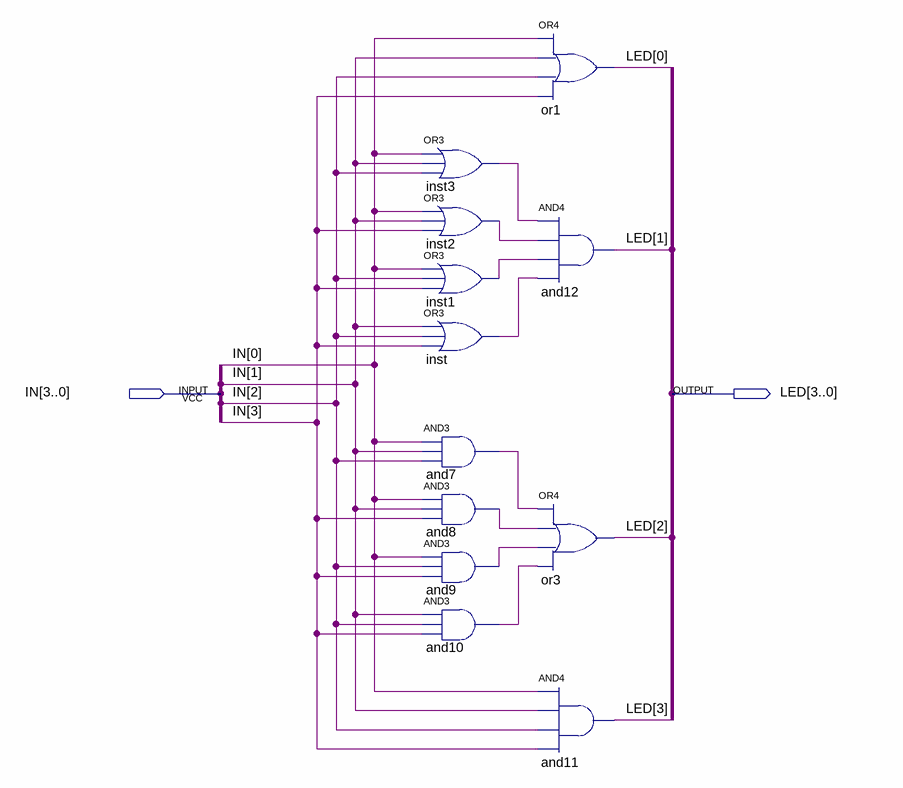
[diagram p0: schematic sheet]
// Quartus schematic SALIDA_LED.bdf as structural Verilog: 12 symbols, 2 pins
module SALIDA_LED (
  input  [3:0] IN,
  output [3:0] LED
);

  wire and7_out, and8_out, and9_out, and10_out, inst1_out, inst2_out, inst3_out, inst_out;

  or inst3 (inst3_out, IN[0], IN[1], IN[2]);
  or inst2 (inst2_out, IN[0], IN[1], IN[3]);
  or inst1 (inst1_out, IN[0], IN[2], IN[3]);
  or inst (inst_out, IN[1], IN[2], IN[3]);
  and and7 (and7_out, IN[0], IN[1], IN[2]);
  and and8 (and8_out, IN[0], IN[1], IN[3]);
  and and9 (and9_out, IN[0], IN[2], IN[3]);
  and and10 (and10_out, IN[1], IN[2], IN[3]);
  or or1 (LED[0], IN[0], IN[1], IN[2], IN[3]);
  and and12 (LED[1], inst3_out, inst2_out, inst1_out, inst_out);
  or or3 (LED[2], and7_out, and8_out, and9_out, and10_out);
  and and11 (LED[3], IN[0], IN[1], IN[2], IN[3]);
endmodule
